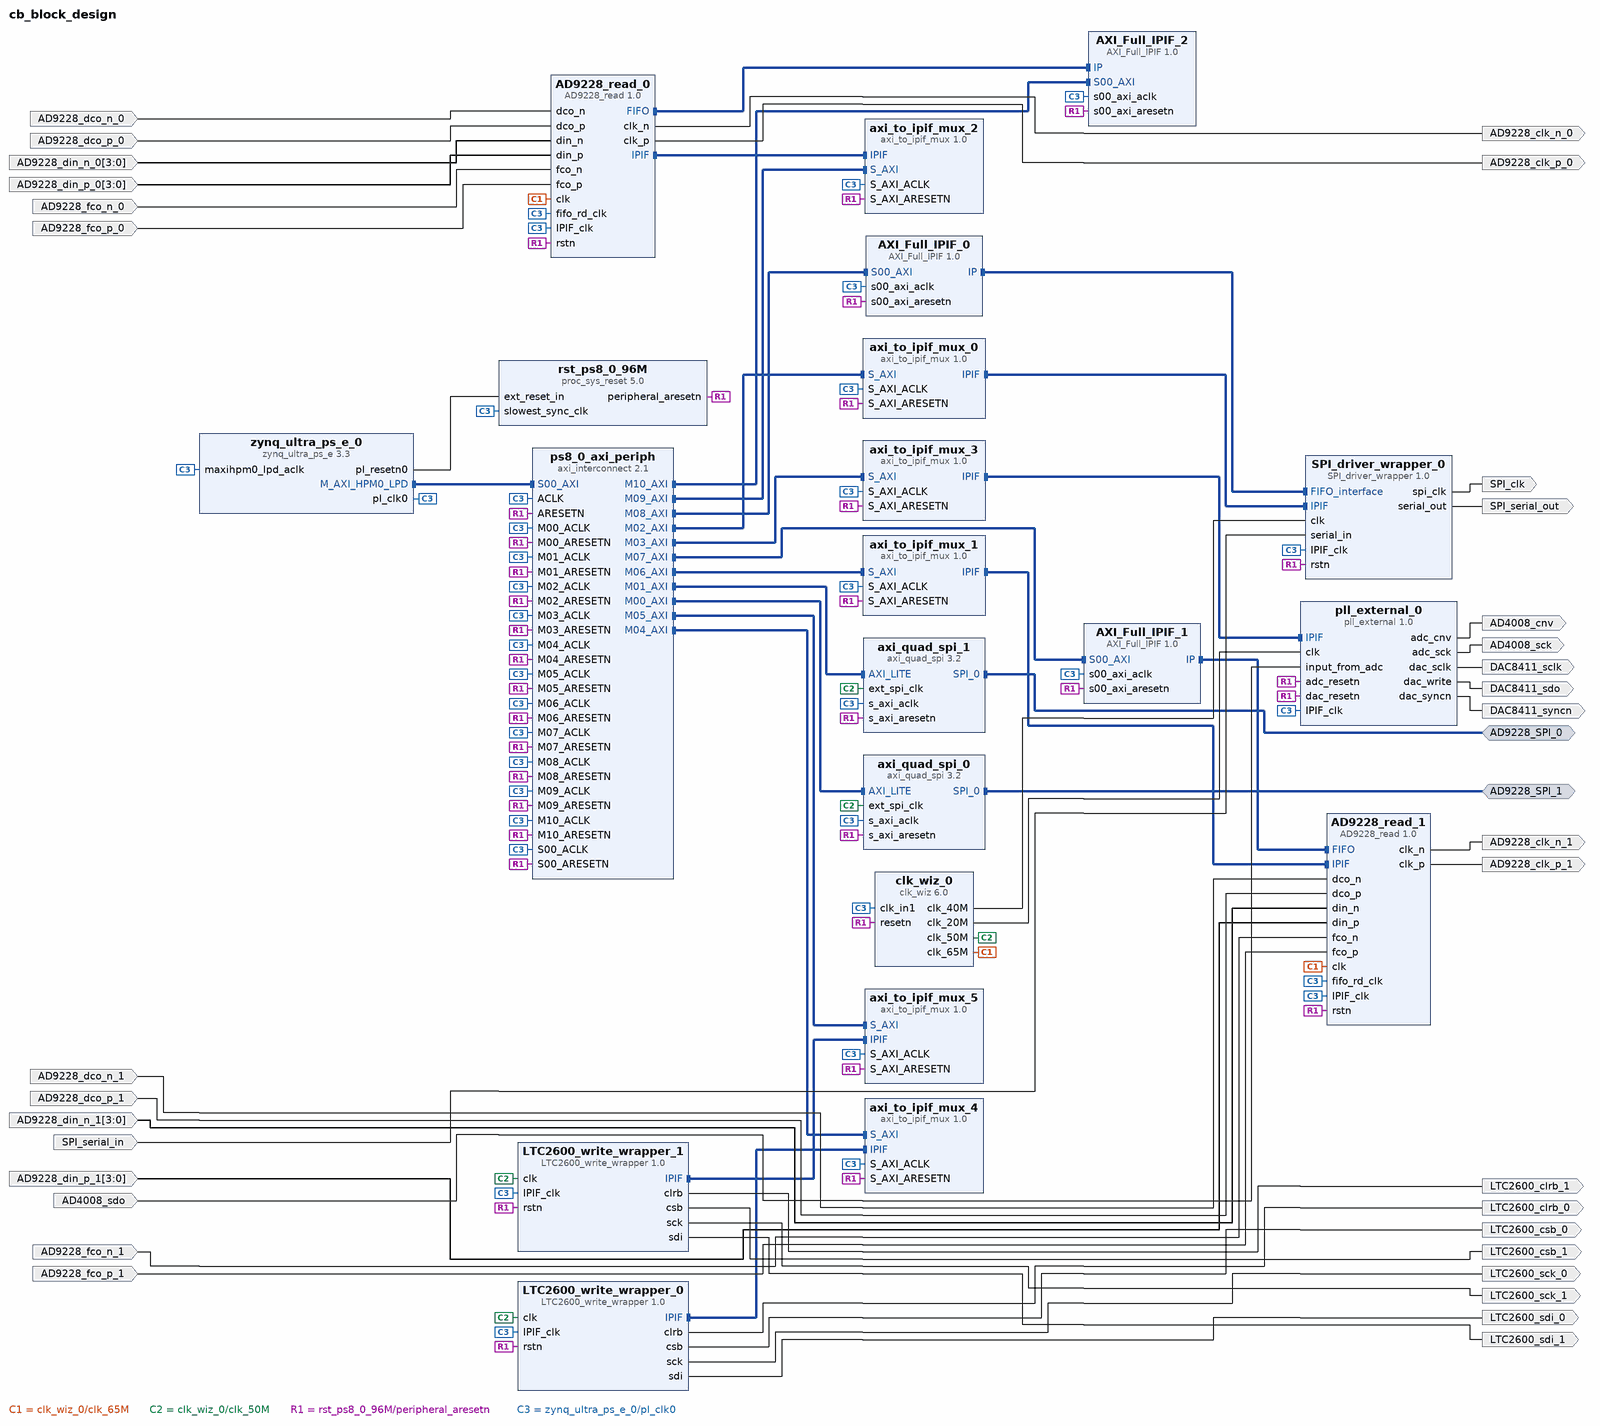
[diagram p0: block diagram of the top level]
# Vivado block design cb_block_design, xck26-sfvc784-2LV-c, Vivado 2021.2
create_bd_design cb_block_design

create_bd_intf_port -mode Master -vlnv xilinx.com:interface:spi_rtl:1.0 AD9228_SPI_1
create_bd_intf_port -mode Master -vlnv xilinx.com:interface:spi_rtl:1.0 AD9228_SPI_0
create_bd_port -dir I SPI_serial_in
create_bd_port -dir O -type clk SPI_clk
create_bd_port -dir O SPI_serial_out
create_bd_port -dir I AD4008_sdo
create_bd_port -dir O AD4008_sck
create_bd_port -dir O DAC8411_sdo
create_bd_port -dir O DAC8411_sclk
create_bd_port -dir O AD4008_cnv
create_bd_port -dir O DAC8411_syncn
create_bd_port -dir O LTC2600_sdi_0
create_bd_port -dir O LTC2600_sck_0
create_bd_port -dir O LTC2600_csb_0
create_bd_port -dir O LTC2600_clrb_0
create_bd_port -dir O LTC2600_sck_1
create_bd_port -dir O LTC2600_csb_1
create_bd_port -dir O LTC2600_sdi_1
create_bd_port -dir O LTC2600_clrb_1
create_bd_port -dir I AD9228_dco_p_1
create_bd_port -dir I AD9228_fco_n_1
create_bd_port -dir I AD9228_fco_p_1
create_bd_port -dir I -from 3 -to 0 AD9228_din_n_1
create_bd_port -dir I -from 3 -to 0 AD9228_din_p_1
create_bd_port -dir I AD9228_dco_n_1
create_bd_port -dir I AD9228_dco_p_0
create_bd_port -dir I AD9228_fco_n_0
create_bd_port -dir I AD9228_fco_p_0
create_bd_port -dir I -from 3 -to 0 AD9228_din_n_0
create_bd_port -dir I -from 3 -to 0 AD9228_din_p_0
create_bd_port -dir I AD9228_dco_n_0
create_bd_port -dir O -type clk AD9228_clk_n_1
create_bd_port -dir O -type clk AD9228_clk_n_0
create_bd_port -dir O -type clk AD9228_clk_p_0
create_bd_port -dir O -type clk AD9228_clk_p_1

create_bd_cell -type ip -vlnv xilinx.com:ip:zynq_ultra_ps_e:3.3 zynq_ultra_ps_e_0
set_property -dict [list \
  CONFIG.PSU__CRL_APB__PL0_REF_CTRL__SRCSEL IOPLL \
  CONFIG.PSU__DDR_HIGH_ADDRESS_GUI_ENABLE 0 \
] [get_bd_cells zynq_ultra_ps_e_0]
# 26 more settings of zynq_ultra_ps_e_0 are not shown: defaults, MIO pin electricals, DDR timing, and values the tool derives
create_bd_cell -type ip -vlnv xilinx.com:ip:axi_quad_spi:3.2 axi_quad_spi_0
set_property -dict {CONFIG.C_SCK_RATIO 2} [get_bd_cells axi_quad_spi_0]
create_bd_cell -type ip -vlnv xilinx.com:ip:axi_interconnect:2.1 ps8_0_axi_periph
set_property -dict {CONFIG.NUM_MI 11 CONFIG.NUM_SI 1} [get_bd_cells ps8_0_axi_periph]
create_bd_cell -type ip -vlnv xilinx.com:ip:proc_sys_reset:5.0 rst_ps8_0_96M
create_bd_cell -type ip -vlnv xilinx.com:ip:axi_quad_spi:3.2 axi_quad_spi_1
set_property -dict {CONFIG.C_SCK_RATIO 2} [get_bd_cells axi_quad_spi_1]
create_bd_cell -type ip -vlnv xilinx.com:ip:clk_wiz:6.0 clk_wiz_0
set_property -dict [list \
  CONFIG.CLKOUT1_JITTER 130.992 \
  CONFIG.CLKOUT1_PHASE_ERROR 82.898 \
  CONFIG.CLKOUT1_REQUESTED_OUT_FREQ 40 \
  CONFIG.CLKOUT2_JITTER 152.526 \
  CONFIG.CLKOUT2_PHASE_ERROR 82.898 \
  CONFIG.CLKOUT2_REQUESTED_OUT_FREQ 20 \
  CONFIG.CLKOUT2_USED true \
  CONFIG.CLKOUT3_JITTER 125.064 \
  CONFIG.CLKOUT3_PHASE_ERROR 82.898 \
  CONFIG.CLKOUT3_REQUESTED_OUT_FREQ 50 \
  CONFIG.CLKOUT3_USED true \
  CONFIG.CLKOUT4_JITTER 118.573 \
  CONFIG.CLKOUT4_PHASE_ERROR 82.898 \
  CONFIG.CLKOUT4_REQUESTED_OUT_FREQ 65 \
  CONFIG.CLKOUT4_USED true \
  CONFIG.CLK_OUT1_PORT clk_40M \
  CONFIG.CLK_OUT2_PORT clk_20M \
  CONFIG.CLK_OUT3_PORT clk_50M \
  CONFIG.CLK_OUT4_PORT clk_65M \
  CONFIG.MMCM_CLKFBOUT_MULT_F 13.000 \
  CONFIG.MMCM_CLKOUT0_DIVIDE_F 32.500 \
  CONFIG.MMCM_CLKOUT1_DIVIDE 65 \
  CONFIG.MMCM_CLKOUT2_DIVIDE 26 \
  CONFIG.MMCM_CLKOUT3_DIVIDE 20 \
  CONFIG.MMCM_DIVCLK_DIVIDE 1 \
  CONFIG.NUM_OUT_CLKS 4 \
  CONFIG.RESET_PORT resetn \
  CONFIG.RESET_TYPE ACTIVE_LOW \
] [get_bd_cells clk_wiz_0]
create_bd_cell -type ip -vlnv xilinx.com:user:pll_external:1.0 pll_external_0
create_bd_cell -type ip -vlnv user.org:user:axi_to_ipif_mux:1.0 axi_to_ipif_mux_0
set_property -dict {CONFIG.MUX_BY_CHIP false CONFIG.N_CHIP 1} [get_bd_cells axi_to_ipif_mux_0]
create_bd_cell -type ip -vlnv user.org:user:AXI_Full_IPIF:1.0 AXI_Full_IPIF_0
create_bd_cell -type ip -vlnv user.org:user:AXI_Full_IPIF:1.0 AXI_Full_IPIF_1
create_bd_cell -type ip -vlnv user.org:user:axi_to_ipif_mux:1.0 axi_to_ipif_mux_1
set_property -dict {CONFIG.MUX_BY_CHIP false CONFIG.N_CHIP 1} [get_bd_cells axi_to_ipif_mux_1]
create_bd_cell -type ip -vlnv user.org:user:AXI_Full_IPIF:1.0 AXI_Full_IPIF_2
create_bd_cell -type ip -vlnv user.org:user:axi_to_ipif_mux:1.0 axi_to_ipif_mux_2
set_property -dict {CONFIG.MUX_BY_CHIP false CONFIG.N_CHIP 1} [get_bd_cells axi_to_ipif_mux_2]
create_bd_cell -type ip -vlnv user.org:user:axi_to_ipif_mux:1.0 axi_to_ipif_mux_3
set_property -dict {CONFIG.MUX_BY_CHIP false CONFIG.N_CHIP 1} [get_bd_cells axi_to_ipif_mux_3]
create_bd_cell -type ip -vlnv user.org:user:axi_to_ipif_mux:1.0 axi_to_ipif_mux_4
set_property -dict {CONFIG.MUX_BY_CHIP false CONFIG.N_CHIP 1} [get_bd_cells axi_to_ipif_mux_4]
create_bd_cell -type ip -vlnv user.org:user:axi_to_ipif_mux:1.0 axi_to_ipif_mux_5
set_property -dict {CONFIG.MUX_BY_CHIP false CONFIG.N_CHIP 1} [get_bd_cells axi_to_ipif_mux_5]
create_bd_cell -type ip -vlnv xilinx.com:user:AD9228_read:1.0 AD9228_read_0
create_bd_cell -type ip -vlnv xilinx.com:user:AD9228_read:1.0 AD9228_read_1
create_bd_cell -type ip -vlnv xilinx.com:user:LTC2600_write_wrapper:1.0 LTC2600_write_wrapper_0
create_bd_cell -type ip -vlnv xilinx.com:user:LTC2600_write_wrapper:1.0 LTC2600_write_wrapper_1
create_bd_cell -type ip -vlnv xilinx.com:user:SPI_driver_wrapper:1.0 SPI_driver_wrapper_0

# ---- connections ----

connect_bd_intf_net [get_bd_intf_pins AXI_Full_IPIF_0/IP] [get_bd_intf_pins SPI_driver_wrapper_0/FIFO_interface]
connect_bd_intf_net [get_bd_intf_pins AXI_Full_IPIF_1/IP] [get_bd_intf_pins AD9228_read_1/FIFO]
connect_bd_intf_net [get_bd_intf_pins AD9228_read_0/FIFO] [get_bd_intf_pins AXI_Full_IPIF_2/IP]
connect_bd_intf_net [get_bd_intf_ports AD9228_SPI_1] [get_bd_intf_pins axi_quad_spi_0/SPI_0]
connect_bd_intf_net [get_bd_intf_ports AD9228_SPI_0] [get_bd_intf_pins axi_quad_spi_1/SPI_0]
connect_bd_intf_net [get_bd_intf_pins axi_to_ipif_mux_0/IPIF] [get_bd_intf_pins SPI_driver_wrapper_0/IPIF]
connect_bd_intf_net [get_bd_intf_pins axi_to_ipif_mux_1/IPIF] [get_bd_intf_pins AD9228_read_1/IPIF]
connect_bd_intf_net [get_bd_intf_pins AD9228_read_0/IPIF] [get_bd_intf_pins axi_to_ipif_mux_2/IPIF]
connect_bd_intf_net [get_bd_intf_pins axi_to_ipif_mux_3/IPIF] [get_bd_intf_pins pll_external_0/IPIF]
connect_bd_intf_net [get_bd_intf_pins LTC2600_write_wrapper_0/IPIF] [get_bd_intf_pins axi_to_ipif_mux_4/IPIF]
connect_bd_intf_net [get_bd_intf_pins LTC2600_write_wrapper_1/IPIF] [get_bd_intf_pins axi_to_ipif_mux_5/IPIF]
connect_bd_intf_net [get_bd_intf_pins ps8_0_axi_periph/M00_AXI] [get_bd_intf_pins axi_quad_spi_0/AXI_LITE]
connect_bd_intf_net [get_bd_intf_pins axi_quad_spi_1/AXI_LITE] [get_bd_intf_pins ps8_0_axi_periph/M01_AXI]
connect_bd_intf_net [get_bd_intf_pins ps8_0_axi_periph/M02_AXI] [get_bd_intf_pins axi_to_ipif_mux_0/S_AXI]
connect_bd_intf_net [get_bd_intf_pins axi_to_ipif_mux_3/S_AXI] [get_bd_intf_pins ps8_0_axi_periph/M03_AXI]
connect_bd_intf_net [get_bd_intf_pins axi_to_ipif_mux_4/S_AXI] [get_bd_intf_pins ps8_0_axi_periph/M04_AXI]
connect_bd_intf_net [get_bd_intf_pins axi_to_ipif_mux_5/S_AXI] [get_bd_intf_pins ps8_0_axi_periph/M05_AXI]
connect_bd_intf_net [get_bd_intf_pins axi_to_ipif_mux_1/S_AXI] [get_bd_intf_pins ps8_0_axi_periph/M06_AXI]
connect_bd_intf_net [get_bd_intf_pins AXI_Full_IPIF_1/S00_AXI] [get_bd_intf_pins ps8_0_axi_periph/M07_AXI]
connect_bd_intf_net [get_bd_intf_pins AXI_Full_IPIF_0/S00_AXI] [get_bd_intf_pins ps8_0_axi_periph/M08_AXI]
connect_bd_intf_net [get_bd_intf_pins axi_to_ipif_mux_2/S_AXI] [get_bd_intf_pins ps8_0_axi_periph/M09_AXI]
connect_bd_intf_net [get_bd_intf_pins AXI_Full_IPIF_2/S00_AXI] [get_bd_intf_pins ps8_0_axi_periph/M10_AXI]
connect_bd_intf_net [get_bd_intf_pins zynq_ultra_ps_e_0/M_AXI_HPM0_LPD] [get_bd_intf_pins ps8_0_axi_periph/S00_AXI]
connect_bd_net [get_bd_pins AD9228_read_0/clk_n] [get_bd_ports AD9228_clk_n_0]
connect_bd_net [get_bd_pins AD9228_read_0/clk_p] [get_bd_ports AD9228_clk_p_0]
connect_bd_net [get_bd_pins AD9228_read_1/clk_n] [get_bd_ports AD9228_clk_n_1]
connect_bd_net [get_bd_pins AD9228_read_1/clk_p] [get_bd_ports AD9228_clk_p_1]
connect_bd_net [get_bd_pins LTC2600_write_wrapper_0/clrb] [get_bd_ports LTC2600_clrb_0]
connect_bd_net [get_bd_pins LTC2600_write_wrapper_0/csb] [get_bd_ports LTC2600_csb_0]
connect_bd_net [get_bd_pins LTC2600_write_wrapper_0/sck] [get_bd_ports LTC2600_sck_0]
connect_bd_net [get_bd_pins LTC2600_write_wrapper_0/sdi] [get_bd_ports LTC2600_sdi_0]
connect_bd_net [get_bd_pins LTC2600_write_wrapper_1/clrb] [get_bd_ports LTC2600_clrb_1]
connect_bd_net [get_bd_pins LTC2600_write_wrapper_1/csb] [get_bd_ports LTC2600_csb_1]
connect_bd_net [get_bd_pins LTC2600_write_wrapper_1/sck] [get_bd_ports LTC2600_sck_1]
connect_bd_net [get_bd_pins LTC2600_write_wrapper_1/sdi] [get_bd_ports LTC2600_sdi_1]
connect_bd_net [get_bd_pins clk_wiz_0/clk_65M] [get_bd_pins AD9228_read_0/clk] [get_bd_pins AD9228_read_1/clk]
connect_bd_net [get_bd_pins SPI_driver_wrapper_0/serial_out] [get_bd_ports SPI_serial_out]
connect_bd_net [get_bd_pins SPI_driver_wrapper_0/spi_clk] [get_bd_ports SPI_clk]
connect_bd_net [get_bd_pins clk_wiz_0/clk_20M] [get_bd_pins pll_external_0/clk]
connect_bd_net [get_bd_pins clk_wiz_0/clk_40M] [get_bd_pins SPI_driver_wrapper_0/clk]
connect_bd_net [get_bd_pins clk_wiz_0/clk_50M] \
  [get_bd_pins axi_quad_spi_1/ext_spi_clk] [get_bd_pins axi_quad_spi_0/ext_spi_clk] [get_bd_pins LTC2600_write_wrapper_0/clk] \
  [get_bd_pins LTC2600_write_wrapper_1/clk]
connect_bd_net -net dco_n_0_1 [get_bd_ports AD9228_dco_n_1] [get_bd_pins AD9228_read_1/dco_n]
connect_bd_net -net dco_n_1_1 [get_bd_ports AD9228_dco_n_0] [get_bd_pins AD9228_read_0/dco_n]
connect_bd_net -net dco_p_0_1 [get_bd_ports AD9228_dco_p_1] [get_bd_pins AD9228_read_1/dco_p]
connect_bd_net -net dco_p_1_1 [get_bd_ports AD9228_dco_p_0] [get_bd_pins AD9228_read_0/dco_p]
connect_bd_net -net din_n_0_1 [get_bd_ports AD9228_din_n_1] [get_bd_pins AD9228_read_1/din_n]
connect_bd_net -net din_n_1_1 [get_bd_ports AD9228_din_n_0] [get_bd_pins AD9228_read_0/din_n]
connect_bd_net -net din_p_0_1 [get_bd_ports AD9228_din_p_1] [get_bd_pins AD9228_read_1/din_p]
connect_bd_net -net din_p_1_1 [get_bd_ports AD9228_din_p_0] [get_bd_pins AD9228_read_0/din_p]
connect_bd_net -net fco_n_0_1 [get_bd_ports AD9228_fco_n_1] [get_bd_pins AD9228_read_1/fco_n]
connect_bd_net -net fco_n_1_1 [get_bd_ports AD9228_fco_n_0] [get_bd_pins AD9228_read_0/fco_n]
connect_bd_net -net fco_p_0_1 [get_bd_ports AD9228_fco_p_1] [get_bd_pins AD9228_read_1/fco_p]
connect_bd_net -net fco_p_1_1 [get_bd_ports AD9228_fco_p_0] [get_bd_pins AD9228_read_0/fco_p]
connect_bd_net -net input_from_adc_0_1 [get_bd_ports AD4008_sdo] [get_bd_pins pll_external_0/input_from_adc]
connect_bd_net [get_bd_pins pll_external_0/adc_cnv] [get_bd_ports AD4008_cnv]
connect_bd_net [get_bd_pins pll_external_0/adc_sck] [get_bd_ports AD4008_sck]
connect_bd_net [get_bd_pins pll_external_0/dac_sclk] [get_bd_ports DAC8411_sclk]
connect_bd_net [get_bd_pins pll_external_0/dac_syncn] [get_bd_ports DAC8411_syncn]
connect_bd_net [get_bd_pins pll_external_0/dac_write] [get_bd_ports DAC8411_sdo]
connect_bd_net [get_bd_pins rst_ps8_0_96M/peripheral_aresetn] \
  [get_bd_pins ps8_0_axi_periph/S00_ARESETN] [get_bd_pins axi_quad_spi_0/s_axi_aresetn] \
  [get_bd_pins ps8_0_axi_periph/M00_ARESETN] [get_bd_pins ps8_0_axi_periph/ARESETN] \
  [get_bd_pins axi_quad_spi_1/s_axi_aresetn] [get_bd_pins ps8_0_axi_periph/M01_ARESETN] [get_bd_pins clk_wiz_0/resetn] \
  [get_bd_pins axi_to_ipif_mux_0/S_AXI_ARESETN] [get_bd_pins ps8_0_axi_periph/M02_ARESETN] \
  [get_bd_pins pll_external_0/dac_resetn] [get_bd_pins pll_external_0/adc_resetn] \
  [get_bd_pins axi_to_ipif_mux_3/S_AXI_ARESETN] [get_bd_pins AXI_Full_IPIF_0/s00_axi_aresetn] \
  [get_bd_pins axi_to_ipif_mux_4/S_AXI_ARESETN] [get_bd_pins axi_to_ipif_mux_5/S_AXI_ARESETN] \
  [get_bd_pins axi_to_ipif_mux_1/S_AXI_ARESETN] [get_bd_pins AXI_Full_IPIF_1/s00_axi_aresetn] \
  [get_bd_pins axi_to_ipif_mux_2/S_AXI_ARESETN] [get_bd_pins AXI_Full_IPIF_2/s00_axi_aresetn] \
  [get_bd_pins AD9228_read_1/rstn] [get_bd_pins AD9228_read_0/rstn] [get_bd_pins ps8_0_axi_periph/M10_ARESETN] \
  [get_bd_pins ps8_0_axi_periph/M09_ARESETN] [get_bd_pins ps8_0_axi_periph/M08_ARESETN] \
  [get_bd_pins ps8_0_axi_periph/M07_ARESETN] [get_bd_pins ps8_0_axi_periph/M06_ARESETN] \
  [get_bd_pins ps8_0_axi_periph/M05_ARESETN] [get_bd_pins ps8_0_axi_periph/M04_ARESETN] \
  [get_bd_pins ps8_0_axi_periph/M03_ARESETN] [get_bd_pins LTC2600_write_wrapper_0/rstn] \
  [get_bd_pins LTC2600_write_wrapper_1/rstn] [get_bd_pins SPI_driver_wrapper_0/rstn]
connect_bd_net -net serial_in_0_1 [get_bd_ports SPI_serial_in] [get_bd_pins SPI_driver_wrapper_0/serial_in]
connect_bd_net [get_bd_pins zynq_ultra_ps_e_0/pl_clk0] \
  [get_bd_pins zynq_ultra_ps_e_0/maxihpm0_lpd_aclk] [get_bd_pins ps8_0_axi_periph/S00_ACLK] \
  [get_bd_pins rst_ps8_0_96M/slowest_sync_clk] [get_bd_pins axi_quad_spi_0/s_axi_aclk] \
  [get_bd_pins ps8_0_axi_periph/M00_ACLK] [get_bd_pins ps8_0_axi_periph/ACLK] [get_bd_pins axi_quad_spi_1/s_axi_aclk] \
  [get_bd_pins ps8_0_axi_periph/M01_ACLK] [get_bd_pins clk_wiz_0/clk_in1] [get_bd_pins axi_to_ipif_mux_0/S_AXI_ACLK] \
  [get_bd_pins ps8_0_axi_periph/M02_ACLK] [get_bd_pins pll_external_0/IPIF_clk] [get_bd_pins axi_to_ipif_mux_3/S_AXI_ACLK] \
  [get_bd_pins AXI_Full_IPIF_0/s00_axi_aclk] [get_bd_pins axi_to_ipif_mux_4/S_AXI_ACLK] \
  [get_bd_pins axi_to_ipif_mux_5/S_AXI_ACLK] [get_bd_pins axi_to_ipif_mux_1/S_AXI_ACLK] \
  [get_bd_pins AXI_Full_IPIF_1/s00_axi_aclk] [get_bd_pins axi_to_ipif_mux_2/S_AXI_ACLK] \
  [get_bd_pins AXI_Full_IPIF_2/s00_axi_aclk] [get_bd_pins AD9228_read_1/IPIF_clk] [get_bd_pins AD9228_read_0/IPIF_clk] \
  [get_bd_pins AD9228_read_0/fifo_rd_clk] [get_bd_pins AD9228_read_1/fifo_rd_clk] [get_bd_pins ps8_0_axi_periph/M03_ACLK] \
  [get_bd_pins ps8_0_axi_periph/M04_ACLK] [get_bd_pins ps8_0_axi_periph/M05_ACLK] [get_bd_pins ps8_0_axi_periph/M06_ACLK] \
  [get_bd_pins ps8_0_axi_periph/M07_ACLK] [get_bd_pins ps8_0_axi_periph/M08_ACLK] [get_bd_pins ps8_0_axi_periph/M09_ACLK] \
  [get_bd_pins ps8_0_axi_periph/M10_ACLK] [get_bd_pins LTC2600_write_wrapper_0/IPIF_clk] \
  [get_bd_pins LTC2600_write_wrapper_1/IPIF_clk] [get_bd_pins SPI_driver_wrapper_0/IPIF_clk]
connect_bd_net [get_bd_pins zynq_ultra_ps_e_0/pl_resetn0] [get_bd_pins rst_ps8_0_96M/ext_reset_in]

# ---- address map ----
assign_bd_address -offset 0x0080000000 -range 64K -target_address_space [get_bd_addr_spaces zynq_ultra_ps_e_0/Data] [get_bd_addr_segs axi_quad_spi_0/AXI_LITE/Reg]
assign_bd_address -offset 0x0080010000 -range 64K -target_address_space [get_bd_addr_spaces zynq_ultra_ps_e_0/Data] [get_bd_addr_segs axi_to_ipif_mux_0/S_AXI/reg0]
assign_bd_address -offset 0x0080020000 -range 64K -target_address_space [get_bd_addr_spaces zynq_ultra_ps_e_0/Data] [get_bd_addr_segs axi_quad_spi_1/AXI_LITE/Reg]
assign_bd_address -offset 0x0080030000 -range 64K -target_address_space [get_bd_addr_spaces zynq_ultra_ps_e_0/Data] [get_bd_addr_segs AXI_Full_IPIF_0/S00_AXI/S00_AXI_mem]
assign_bd_address -offset 0x0080040000 -range 64K -target_address_space [get_bd_addr_spaces zynq_ultra_ps_e_0/Data] [get_bd_addr_segs AXI_Full_IPIF_1/S00_AXI/S00_AXI_mem]
assign_bd_address -offset 0x0080050000 -range 64K -target_address_space [get_bd_addr_spaces zynq_ultra_ps_e_0/Data] [get_bd_addr_segs AXI_Full_IPIF_2/S00_AXI/S00_AXI_mem]
assign_bd_address -offset 0x0080060000 -range 64K -target_address_space [get_bd_addr_spaces zynq_ultra_ps_e_0/Data] [get_bd_addr_segs axi_to_ipif_mux_1/S_AXI/reg0]
assign_bd_address -offset 0x0080070000 -range 64K -target_address_space [get_bd_addr_spaces zynq_ultra_ps_e_0/Data] [get_bd_addr_segs axi_to_ipif_mux_2/S_AXI/reg0]
assign_bd_address -offset 0x0080080000 -range 64K -target_address_space [get_bd_addr_spaces zynq_ultra_ps_e_0/Data] [get_bd_addr_segs axi_to_ipif_mux_3/S_AXI/reg0]
assign_bd_address -offset 0x0080090000 -range 64K -target_address_space [get_bd_addr_spaces zynq_ultra_ps_e_0/Data] [get_bd_addr_segs axi_to_ipif_mux_4/S_AXI/reg0]
assign_bd_address -offset 0x00800A0000 -range 64K -target_address_space [get_bd_addr_spaces zynq_ultra_ps_e_0/Data] [get_bd_addr_segs axi_to_ipif_mux_5/S_AXI/reg0]

validate_bd_design
save_bd_design
